# Altium schematic sheet topLevel.SchDoc: Edison Breakout
size Letter; Author: Ye-Sheng Kuo; Revision: 1; SheetTotal: 9
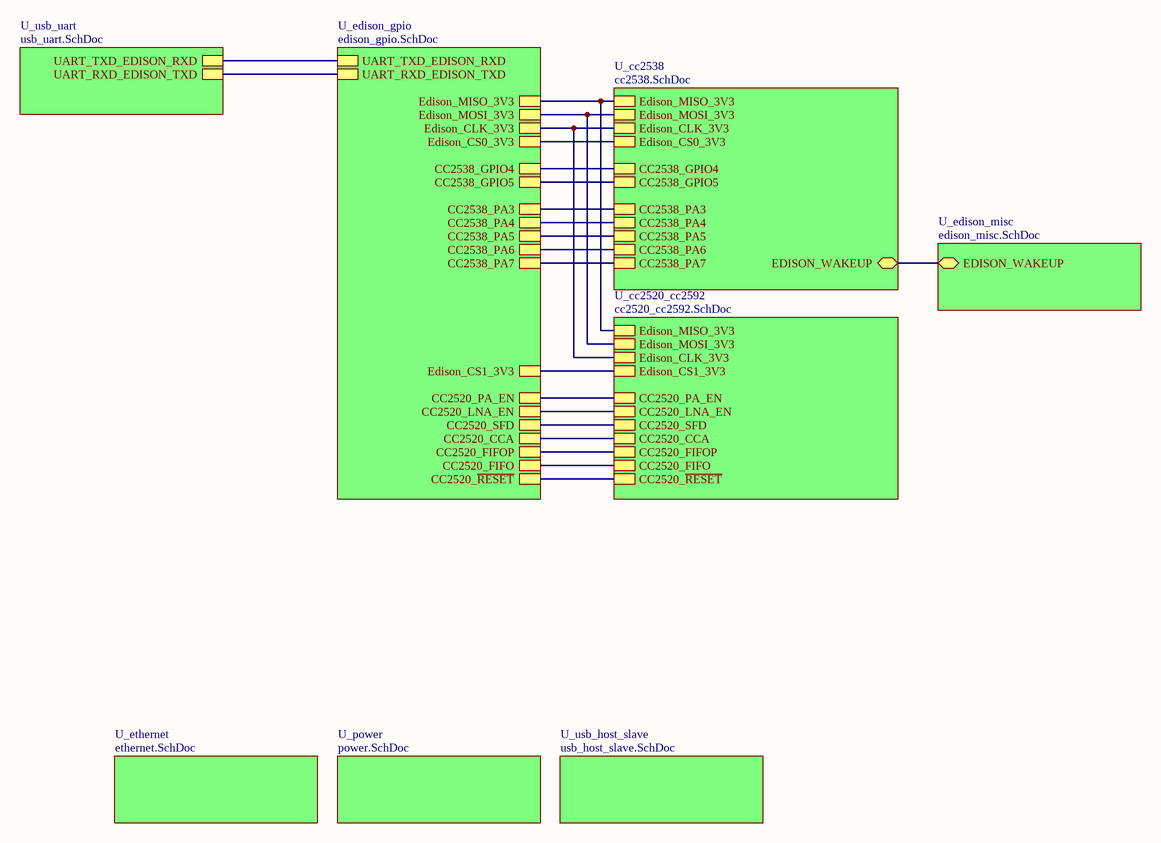
[diagram p0: topLevel.SchDoc]

## Sub-sheets
U_cc2520_cc2592 = cc2520_cc2592.SchDoc: CC2520_PA_EN, CC2520_LNA_EN, CC2520_SFD, CC2520_CCA, CC2520_FIFOP, CC2520_FIFO, CC2520_~{RESET}, Edison_MISO_3V3, Edison_MOSI_3V3, Edison_CLK_3V3, Edison_CS1_3V3
U_cc2538 = cc2538.SchDoc: CC2538_PA3, CC2538_PA4, CC2538_PA5, CC2538_PA6, CC2538_PA7, Edison_MISO_3V3, Edison_MOSI_3V3, Edison_CLK_3V3, Edison_CS0_3V3, CC2538_GPIO4, CC2538_GPIO5, EDISON_WAKEUP
U_edison_gpio = edison_gpio.SchDoc: UART_TXD_EDISON_RXD, UART_RXD_EDISON_TXD, Edison_MISO_3V3, Edison_MOSI_3V3, Edison_CLK_3V3, Edison_CS0_3V3, CC2538_GPIO4, CC2538_GPIO5, CC2538_PA3, CC2538_PA4, CC2538_PA5, CC2538_PA6, CC2538_PA7, Edison_CS1_3V3, CC2520_PA_EN, CC2520_LNA_EN, CC2520_SFD, CC2520_CCA, CC2520_FIFOP, CC2520_FIFO, CC2520_~{RESET}
U_edison_misc = edison_misc.SchDoc: EDISON_WAKEUP
U_ethernet = ethernet.SchDoc: no entries
U_power = power.SchDoc: no entries
U_usb_host_slave = usb_host_slave.SchDoc: no entries
U_usb_uart = usb_uart.SchDoc: UART_TXD_EDISON_RXD, UART_RXD_EDISON_TXD

## Nets
(unnamed): sheet U_cc2538/CC2538_PA3, sheet U_edison_gpio/CC2538_PA3
(unnamed): sheet U_cc2538/CC2538_PA4, sheet U_edison_gpio/CC2538_PA4
(unnamed): sheet U_cc2538/CC2538_PA5, sheet U_edison_gpio/CC2538_PA5
(unnamed): sheet U_cc2538/CC2538_PA6, sheet U_edison_gpio/CC2538_PA6
(unnamed): sheet U_cc2538/CC2538_PA7, sheet U_edison_gpio/CC2538_PA7
(unnamed): sheet U_cc2538/Edison_MISO_3V3, sheet U_edison_gpio/Edison_MISO_3V3, sheet U_cc2520_cc2592/Edison_MISO_3V3
(unnamed): sheet U_cc2538/Edison_MOSI_3V3, sheet U_edison_gpio/Edison_MOSI_3V3, sheet U_cc2520_cc2592/Edison_MOSI_3V3
(unnamed): sheet U_cc2538/Edison_CLK_3V3, sheet U_edison_gpio/Edison_CLK_3V3, sheet U_cc2520_cc2592/Edison_CLK_3V3
(unnamed): sheet U_cc2538/Edison_CS0_3V3, sheet U_edison_gpio/Edison_CS0_3V3
(unnamed): sheet U_cc2538/CC2538_GPIO4, sheet U_edison_gpio/CC2538_GPIO4
(unnamed): sheet U_cc2538/CC2538_GPIO5, sheet U_edison_gpio/CC2538_GPIO5
(unnamed): sheet U_cc2538/EDISON_WAKEUP, sheet U_edison_misc/EDISON_WAKEUP
(unnamed): sheet U_edison_gpio/UART_TXD_EDISON_RXD, sheet U_usb_uart/UART_TXD_EDISON_RXD
(unnamed): sheet U_edison_gpio/UART_RXD_EDISON_TXD, sheet U_usb_uart/UART_RXD_EDISON_TXD
(unnamed): sheet U_edison_gpio/Edison_CS1_3V3, sheet U_cc2520_cc2592/Edison_CS1_3V3
(unnamed): sheet U_edison_gpio/CC2520_PA_EN, sheet U_cc2520_cc2592/CC2520_PA_EN
(unnamed): sheet U_edison_gpio/CC2520_LNA_EN, sheet U_cc2520_cc2592/CC2520_LNA_EN
(unnamed): sheet U_edison_gpio/CC2520_SFD, sheet U_cc2520_cc2592/CC2520_SFD
(unnamed): sheet U_edison_gpio/CC2520_CCA, sheet U_cc2520_cc2592/CC2520_CCA
(unnamed): sheet U_edison_gpio/CC2520_FIFOP, sheet U_cc2520_cc2592/CC2520_FIFOP
(unnamed): sheet U_edison_gpio/CC2520_FIFO, sheet U_cc2520_cc2592/CC2520_FIFO
(unnamed): sheet U_edison_gpio/CC2520_~{RESET}, sheet U_cc2520_cc2592/CC2520_~{RESET}

## Notes on the sheet
- Title
- Date:
- Author:
- Revision:
- Sheet
- of
- University of Michigan
- File: